# Altium project EnergyMeter_v2.PrjPCB
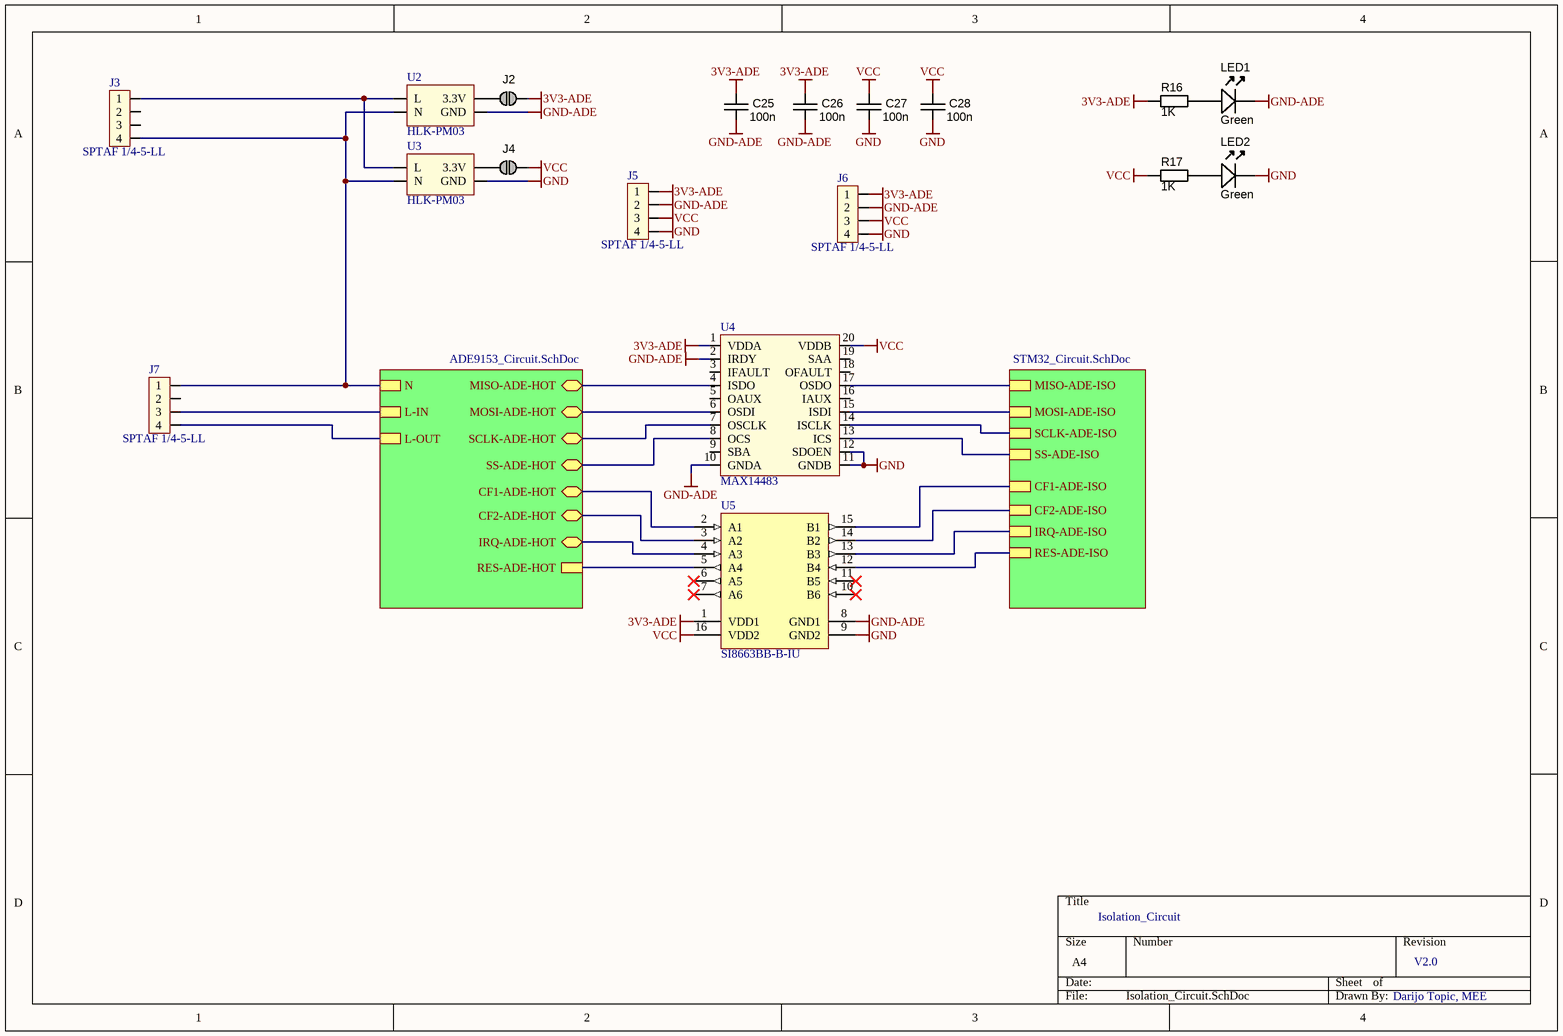
[diagram p0: Isolation_Circuit.SchDoc]
3 sheets, 121 parts. Net scope: hierarchical (ports join the sheet entries above them; power ports are global).
Board files: EnergyMeterV2.PcbDoc, EMv2PowerSupply.PcbDoc, EMv2MainBoard.PcbDoc
Sheets:
  Isolation_Circuit.SchDoc
    Designator = ADE9153_Circuit.SchDoc
    Designator = STM32_Circuit.SchDoc

## Sheet Isolation_Circuit.SchDoc
size A4

### Parts
C25  value 100n  [CAPC2012X135N]  (hidden comment: approved sub OK)
C26  value 100n  [CAPC2012X135N]  (hidden comment: approved sub OK)
C27  value 100n  [CAPC2012X135N]  (hidden comment: approved sub OK)
C28  value 100n  [CAPC2012X135N]  (hidden comment: approved sub OK)
J2  Jumper  [HDR1X2]  (value not drawn)  (no BOM)
J3  SPTAF 1/4-5-LL  [SPTAF 1/4-5-LL]
J4  Jumper  [HDR1X2]  (value not drawn)  (no BOM)
J5  SPTAF 1/4-5-LL  [SPTAF 1/4-5-LL]
J6  SPTAF 1/4-5-LL  [SPTAF 1/4-5-LL]
J7  SPTAF 1/4-5-LL  [SPTAF 1/4-5-LL]
LED1  Color: Green  [LED-0805-K]
LED2  Color: Green  [LED-0805-K]
R16  value 1K  [RESC2012X70N]  (hidden comment: Thick Film)
R17  value 1K  [RESC2012X70N]  (hidden comment: Thick Film)
U2  HLK-PM03  [HLK-PM03]
U3  HLK-PM03  [HLK-PM03]
U4  MAX14483  [SSOP20]
U5  SI8663BB-B-IU  [QSOP16]

### Sub-sheets
Designator = ADE9153_Circuit.SchDoc: CF2-ADE-HOT (bidir), IRQ-ADE-HOT (bidir), RES-ADE-HOT, MOSI-ADE-HOT (bidir), MISO-ADE-HOT (bidir), SCLK-ADE-HOT (bidir), SS-ADE-HOT (bidir), CF1-ADE-HOT (bidir), L-IN, L-OUT, N
Designator = STM32_Circuit.SchDoc: SS-ADE-ISO, MISO-ADE-ISO, CF1-ADE-ISO, CF2-ADE-ISO, IRQ-ADE-ISO, RES-ADE-ISO, MOSI-ADE-ISO, SCLK-ADE-ISO

### Nets
3V3-ADE: C25.1 C26.1 J2.1 J5.1 J6.1 R16.1 U4.1(VDDA) U5.1(VDD1)
GND: C27.2 C28.2 J5.4 J6.4 LED2.K U3.3(GND) U4.11(GNDB) U4.12(SDOEN) U5.9(GND2)
GND-ADE: C25.2 C26.2 J5.2 J6.2 LED1.K U2.3(GND) U4.2(IRDY) U4.10(GNDA) U5.8(GND1)
VCC: C27.1 C28.1 J4.1 J5.3 J6.3 R17.1 U4.20(VDDB) U5.16(VDD2)
RES-ADE-HOT: U5.5(A4) ; sheet Designator/RES-ADE-HOT
SS-ADE-HOT: U4.8(OCS) ; sheet Designator/SS-ADE-HOT
NetIC?_17: U5.14(B2) ; sheet Designator/CF2-ADE-ISO
NetIC?_20: U5.12(B4) ; sheet Designator/RES-ADE-ISO
NetIC?_21: U4.14(ISCLK) ; sheet Designator/SCLK-ADE-ISO
NetIC?_22: U4.17(OSDO) ; sheet Designator/MISO-ADE-ISO
NetIC?_23: U4.15(ISDI) ; sheet Designator/MOSI-ADE-ISO
NetIC?_24: U4.13(ICS) ; sheet Designator/SS-ADE-ISO
NetIC?_25: U5.15(B1) ; sheet Designator/CF1-ADE-ISO
NetIC?_27: U5.13(B3) ; sheet Designator/IRQ-ADE-ISO
NetJ2_2: J2.2 U2.4(3.3V)
NetJ3_1: J3.1 U2.1(L) U3.1(L)
NetJ3_4: J3.4 J7.1 U2.2(N) U3.2(N) ; sheet Designator/N
NetJ4_2: J4.2 U3.4(3.3V)
NetJ7_3: J7.3 ; sheet Designator/L-IN
NetJ7_4: J7.4 ; sheet Designator/L-OUT
NetLED1_A: LED1.A R16.2
NetLED2_A: LED2.A R17.2
NetU1_25: U5.3(A2) ; sheet Designator/CF2-ADE-HOT
NetU1_26: U5.2(A1) ; sheet Designator/CF1-ADE-HOT
NetU1_27: U5.4(A3) ; sheet Designator/IRQ-ADE-HOT
NetU1_29: U4.6(OSDI) ; sheet Designator/MOSI-ADE-HOT
NetU1_30: U4.4(ISDO) ; sheet Designator/MISO-ADE-HOT
NetU1_31: U4.7(OSCLK) ; sheet Designator/SCLK-ADE-HOT

Not connected (* = marked no-connect by the designer): J3 2 3; J7 2; U4 3(IFAULT) 5(OAUX) 9(SBA) 16(IAUX) 18(OFAULT) 19(SAA); U5 6(A5)* 7(A6)* 10(B6)* 11(B5)*

### Notes on the sheet
- Isolation_Circuit
- V2.0
- Darijo Topic, MEE

### Library data of the parts
C25-C28 = CAPC_100n_0805_X7R_50V_10%: Capacitor SMD Cer 100nF 10% 50V X7R 0805; Manufacturer 1: Kemet; Manufacturer Part Number 1: C0805C104K5RACTU; Ratings: 50V; X7R; Material: ceramic; SCDType: undef; Package / Case: 0805 (2012 metric); Tolerance: ±10%; Supplier 1: Digi-Key; Supplier Part Number 1: 399-1170-1-ND
J2 J4 = JUMP1: SMD jumper
LED1 LED2 = LED_SMD_Green_0805_6mcd: LED, 0805 SMD, Green; Manufacturer 1: LITE-ON; Manufacturer Part Number 1: LTST-C171GKT; Material: GaP; Ratings: 6 mcd; 569 nm; SCDType: source; Package / Case: 0805; Supplier 1: Digi-Key; Supplier Part Number 1: 160-1423-1-ND; Value: Green
R16 R17 = RES_1K_0805_1%: Resistor SMD chip 1k Ohm 0.125W 1% 0805; Manufacturer 1: Vishay/Dale; Manufacturer Part Number 1: CRCW08051K00FKEA; Ratings: 1/8W; SCDType: spec; Supplier 1: Digi-Key; Supplier Part Number 1: 541-1.00KCCT-ND; Package / Case: 0805 (2012 metric); Tolerance: ±1%
U2 U3 = HLK-PM03: AC 220V to DC 3.3V
U4 = MAX14483: 6-Channel, Low-Power, / 3.75kVRMS, SPI Digital Isolator; Mouser: 700-MAX14483AAP+
U5 = Si8663BC-B-IS1: Low Power Six-Channel Digital Isolator, 150 Mbps, 3.75 kVRMS Isolation Rating, -40 to 125 degC, 16-pin SOIC; Manufacturer: Silicon Labs; 10kV surge: FALSE; Channel Type: Unidirectional; Isolation Rating (kV): 3.75; Maximum Data Rate (Mbps): 150; Maximum Propagation Delay (ns): 13; Sub-Family: Isolators; DatasheetVersion: Rev. 1.4; PackageReference: SOIC-16-NB; PackageDescription: 16-Pin Small-Outline Integrated Circuit, Body 9.9 x 3.9 mm, Pitch 1.27 mm; Supplier 1: Digi-Key; Supplier Part Number 1: 336-2128-5-ND; Supplier 2: Mouser; Supplier Part Number 2: 634-SI8663BC-B-IS1; AEC-Q100: FALSE; Enable Control: FALSE; Mounting Technology: Surface Mount; Code_JEDEC: MS-012; Code_IPC: J-STD-020; PartNumber: Si8663BC-B-IS1; ComponentLink1Description: Manufacturer URL; ComponentLink1URL: http://www.silabs.com/; ComponentLink2Description: Datasheet; ComponentLink2URL: http://www.silabs.com/Support%20Documents/TechnicalDocs/Si866x.pdf; ComponentLink3Description: Package Specification; ComponentLink3URL: http://www.silabs.com/Support%20Documents/TechnicalDocs/si2401.pdf; Mouser: 634-SI8660BB-B-IU

## Sheet ADE9153_Circuit.SchDoc
size A
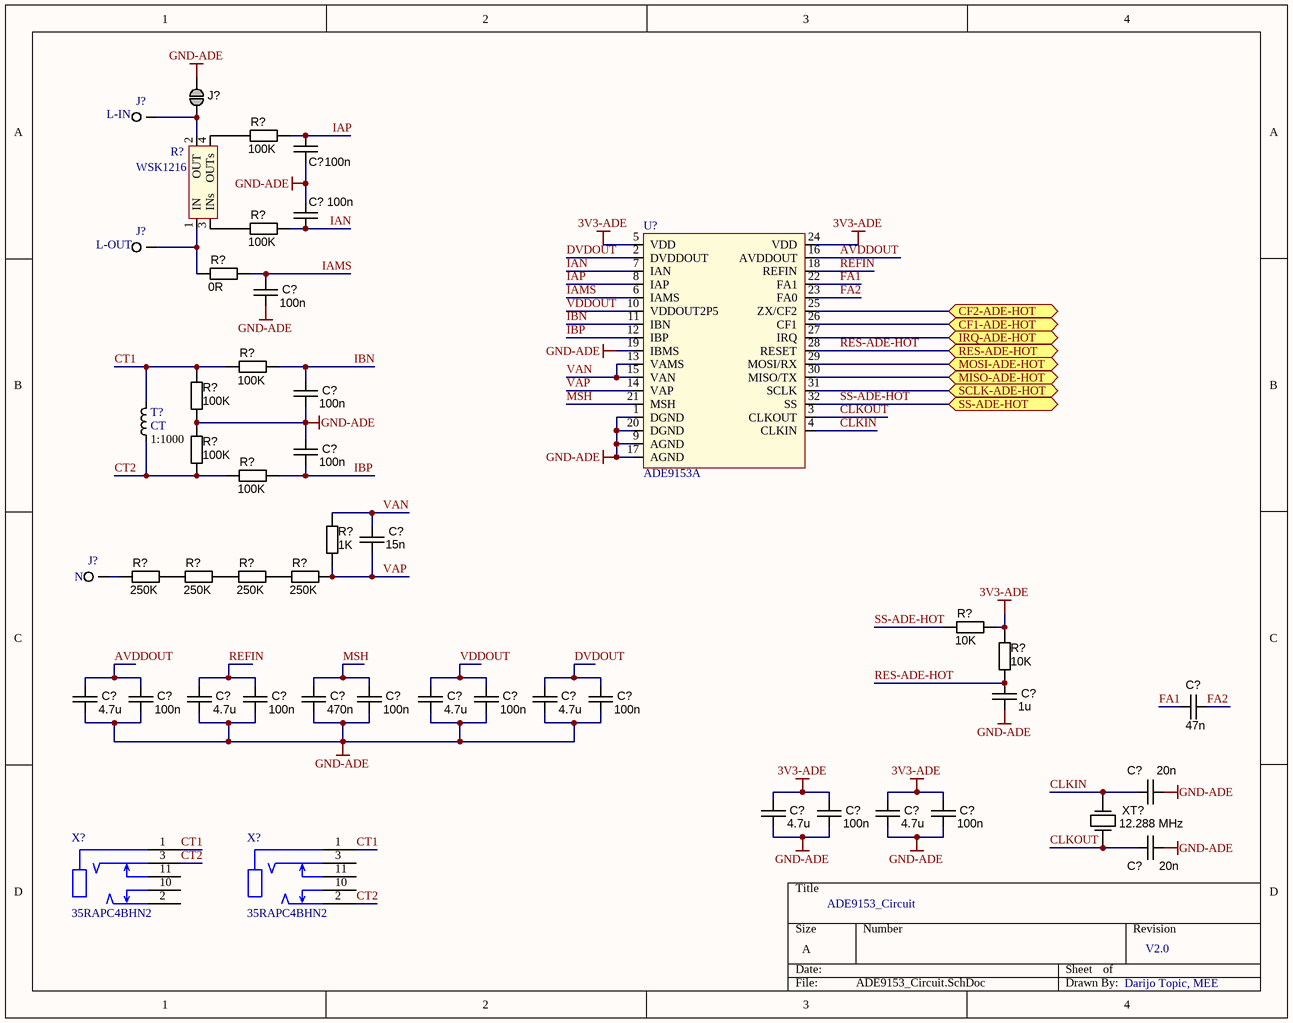
[diagram p1: ADE9153_Circuit.SchDoc]

### Parts
(Parts that share a designator on the sheet are numbered #1, #2 ... from top to bottom, then left to right.)
C1  value 100n  [CAPC2012X135N]  (hidden comment: approved sub OK)
C2  value 100n  [CAPC2012X135N]  (hidden comment: approved sub OK)
C3  value 100n  [CAPC2012X135N]  (hidden comment: approved sub OK)
C4  value 100n  [CAPC2012X135N]  (hidden comment: approved sub OK)
C5  value 100n  [CAPC2012X135N]  (hidden comment: approved sub OK)
C6  value 15n  [CAPC2012X135N]  (hidden comment: approved sub OK)
C7  value 47n  [CAPC2012X135N]  (hidden comment: approved sub OK)
C8  value 1u  [CAPC2012X135N]  (hidden comment: approved sub OK)
C9  value 4.7u  [CAPC2012X135N]  (hidden comment: approved sub OK)
C10  value 100n  [CAPC2012X135N]  (hidden comment: approved sub OK)
C11  value 4.7u  [CAPC2012X135N]  (hidden comment: approved sub OK)
C12  value 100n  [CAPC2012X135N]  (hidden comment: approved sub OK)
C13  value 470n  [CAPC2012X135N]  (hidden comment: approved sub OK)
C14  value 100n  [CAPC2012X135N]  (hidden comment: approved sub OK)
C15  value 4.7u  [CAPC2012X135N]  (hidden comment: approved sub OK)
C16  value 100n  [CAPC2012X135N]  (hidden comment: approved sub OK)
C17  value 4.7u  [CAPC2012X135N]  (hidden comment: approved sub OK)
C18  value 100n  [CAPC2012X135N]  (hidden comment: approved sub OK)
C19  value 20n  [CAPC2012X135N]  (hidden comment: approved sub OK)
C20  value 4.7u  [CAPC2012X135N]  (hidden comment: approved sub OK)
C21  value 100n  [CAPC2012X135N]  (hidden comment: approved sub OK)
C22  value 4.7u  [CAPC2012X135N]  (hidden comment: approved sub OK)
C23  value 100n  [CAPC2012X135N]  (hidden comment: approved sub OK)
C24  value 20n  [CAPC2012X135N]  (hidden comment: approved sub OK)
J?#1  L-IN  [Crimp Spade PCB 6.3mm]
J?#2  Jumper  [HDR1X2]  (value not drawn)  (no BOM)
J?#3  L-OUT  [Crimp Spade PCB 6.3mm]
J?#4  N  [Crimp Spade PCB 6.3mm]
R1  value 100K  [RESC2012X70N]  (hidden comment: Thick Film)
R2  WSK1216  [WSK1216]
R3  value 100K  [RESC2012X70N]  (hidden comment: Thick Film)
R4  value 0R  [RESC2012X70N]  (hidden comment: Thick Film)
R5  value 100K  [RESC2012X70N]  (hidden comment: Thick Film)
R6  value 100K  [RESC2012X70N]  (hidden comment: Thick Film)
R7  value 100K  [RESC2012X70N]  (hidden comment: Thick Film)
R8  value 100K  [RESC2012X70N]  (hidden comment: Thick Film)
R9  value 1K  [RESC2012X70N]  (hidden comment: Thick Film)
R10  value 250K  [RESC2012X70N]  (hidden comment: Thick Film)
R11  value 250K  [RESC2012X70N]  (hidden comment: Thick Film)
R12  value 250K  [RESC2012X70N]  (hidden comment: Thick Film)
R13  value 250K  [RESC2012X70N]  (hidden comment: Thick Film)
R14  value 10K  [RESC2012X70N]  (hidden comment: Thick Film)
R15  value 10K  [RESC2012X70N]  (hidden comment: Thick Film)
T?  CT  Ratio: 1:1000
U1  ADE9153A  [CP-32-12_L]
X2  35RAPC4BHN2  [35RAPC _ _ HN2]
X?  35RAPC4BHN2  [35RAPC _ _ HN2]
XT1  12.288 MHz  [ABLS7M2]

### Ports
CF1-ADE-HOT (bidir), CF2-ADE-HOT (bidir), IRQ-ADE-HOT (bidir), MISO-ADE-HOT (bidir), MOSI-ADE-HOT (bidir), RES-ADE-HOT (bidir), SCLK-ADE-HOT (bidir), SS-ADE-HOT (bidir)

### Nets
3V3-ADE: C20.1 C21.1 C22.1 C23.1 R14.1 R15.1 U1.5(VDD) U1.24(VDD)
GND-ADE: C1.2 C2.1 C3.2 C4.2 C5.1 C8.2 C9.2 C10.2 C11.2 C12.2 C13.2 C14.2 C15.2 C16.2 C17.2 C18.2 C19.1 C20.2 C21.2 C22.2 C23.2 C24.1 J?#2.1 R6.2 R7.1 U1.1(DGND) U1.9(AGND) U1.17(AGND) U1.19(IBMS) U1.20(DGND)
AVDDOUT: C9.1 C10.1 U1.16(AVDDOUT)
CLKIN: C19.2 U1.4(CLKIN) XT1.2(OUT)
CLKOUT: C24.2 U1.3(CLKOUT) XT1.1(IN)
CT1: R5.2 R6.1 T?.1 X2.1 X?.1
CT2: R7.2 R8.2 T?.2 X2.2 X?.3
DVDOUT: C17.1 C18.1 U1.2(DVDDOUT)
FA1: C7.1 U1.22(FA1)
FA2: C7.2 U1.23(FA0)
IAMS: C3.1 R4.1 U1.6(IAMS)
IAN: C2.2 R3.1 U1.7(IAN)
IAP: C1.1 R1.1 U1.8(IAP)
IBN: C4.1 R5.1 U1.11(IBN)
IBP: C5.2 R8.1 U1.12(IBP)
MSH: C13.1 C14.1 U1.21(MSH)
REFIN: C11.1 C12.1 U1.18(REFIN)
RES-ADE-HOT: C8.1 R15.2 U1.28(RESET) ; port RES-ADE-HOT
SS-ADE-HOT: R14.2 U1.32(SS) ; port SS-ADE-HOT
VAN: C6.1 R9.1 U1.13(VAMS) U1.15(VAN)
VAP: C6.2 R9.2 R13.1 U1.14(VAP)
VDDOUT: C15.1 C16.1 U1.10(VDDOUT2P5)
NetJ?#1_1: J?#1.1 J?#2.2 R2.2(OUT)
NetJ?#3_1: J?#3.1 R2.1(IN) R4.2
NetJ?#4_1: J?#4.1 R10.2
NetR1_2: R1.2 R2.4(OUTs)
NetR2_3: R2.3(INs) R3.2
NetU1_25: U1.25(ZX/CF2) ; port CF2-ADE-HOT
NetU1_26: U1.26(CF1) ; port CF1-ADE-HOT
NetU1_27: U1.27(IRQ) ; port IRQ-ADE-HOT
NetU1_29: U1.29(MOSI/RX) ; port MOSI-ADE-HOT
NetU1_30: U1.30(MISO/TX) ; port MISO-ADE-HOT
NetU1_31: U1.31(SCLK) ; port SCLK-ADE-HOT

Not connected (* = marked no-connect by the designer): R10 1; R11 1 2; R12 1 2; R13 2; X2 3 10 11; X? 2 10 11

### Notes on the sheet
- ADE9153_Circuit
- V2.0
- Darijo Topic, MEE

### Library data of the parts
C1-C24 = CAPC_100n_0805_X7R_50V_10%: as C25 on sheet Isolation_Circuit; Package / Case: 0805 (2012 metric); Tolerance: ±10%; Supplier 1: Digi-Key; Supplier Part Number 1: 399-1170-1-ND
J?#1 J?#3 J?#4 = Crimp Spade Connector: Crimp Spade Connector 6.3mm
J?#2 = JUMP1: SMD jumper
R1 R3-R15 = RES_100K_0805_1%: Resistor SMD chip 100k Ohm 0.125W 1% 0805; Manufacturer 1: Vishay/Dale; Manufacturer Part Number 1: CRCW0805100KFKEA; Ratings: 1/8W; SCDType: spec; Package / Case: 0805 (2012 metric); Supplier 1: Digi-Key; Supplier Part Number 1: 541-100KCCT-ND
R2 = wsk1216: Power Metal Strip® Resistors, Low Value, / High Power, Surface-Mount, 4-Terminal; Mouser: 71-WSK12161L000FEA
T? = Current Transformer
U1 = ADE9153A: Energy Metering IC with Autocalibration; Mouser: 584-ADE9153AACPZ
X2 X? = Audio jack 35RAPC4BHN2: Switchcraft 35RAPC4BHN2, 3.5mm stereo jack
XT1 = Crystal_6MHz_HC49/US: Resonator Ceramic 6.00 MHz 30ppm; Manufacturer 1: CTS-Frequency Controls; Manufacturer Part Number 1: ATS060BSM-1; Frequency: 6MHz; Frequency Stability: ±50ppm; Load Capacitance: 18pF; Operating Mode: Fundamental; Parameter Name: 0.169" (4.30mm); SCDType: spec; Package / Case: HC49/US-SM; Ratings: 6.00 MHz; Supplier 1: Digi-Key; Supplier Part Number 1: CTX882CT-ND; Type: MHz Crystal; Frequency Tolerance: ±30ppm; Operating Temperature: -20°C ~ 70°C; Mounting Type: Surface Mount; Size / Dimension: 0.437" L x 0.190" W (11.10mm x 4.83mm); ComponentLink1URL: http://www.ctscorp.com/components/Datasheets/008-0309-0.pdf; ComponentLink1Description: http://www.ctscorp.com/components/Datasheets/008-0309-0.pdf

## Sheet STM32_Circuit.SchDoc
size A4
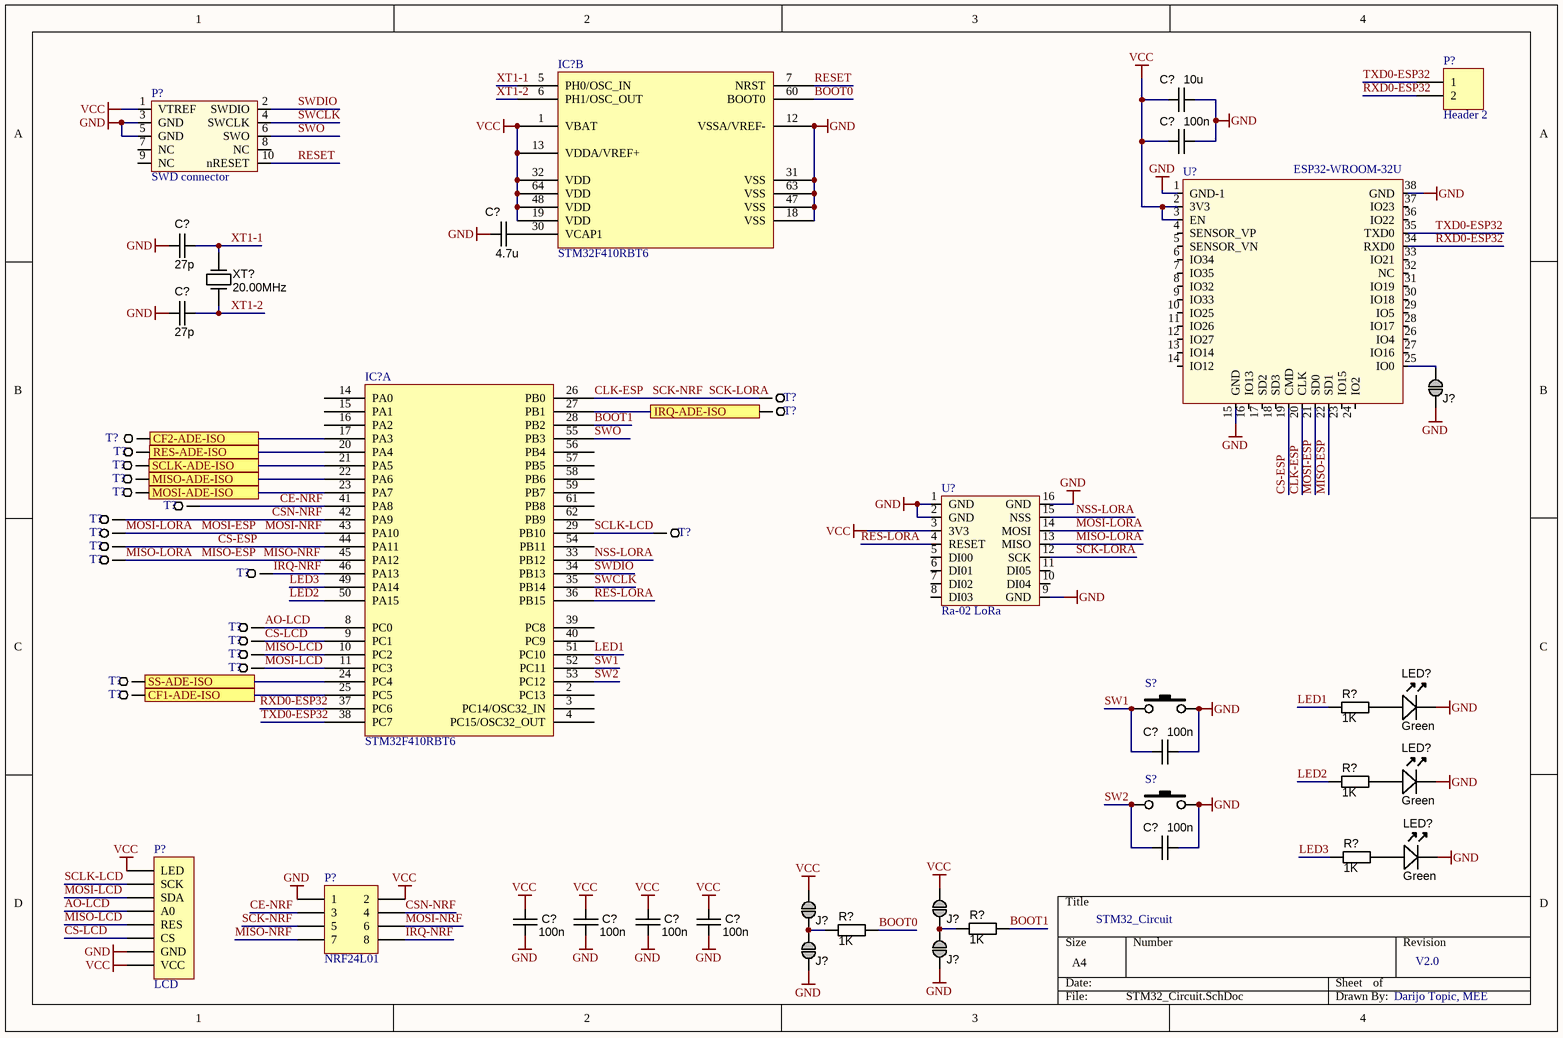
[diagram p2: STM32_Circuit.SchDoc]

### Parts
(Parts that share a designator on the sheet are numbered #1, #2 ... from top to bottom, then left to right.)
C29  value 10u  [CAPC2012X135N]  (hidden comment: approved sub OK)
C30  value 100n  [CAPC2012X135N]  (hidden comment: approved sub OK)
C31  value 4.7u  [CAPC2012X135N]  (hidden comment: approved sub OK)
C32  value 27p  [CAPC2012X135N]  (hidden comment: approved sub OK)
C33  value 27p  [CAPC2012X135N]  (hidden comment: approved sub OK)
C34  value 100n  [CAPC2012X135N]  (hidden comment: approved sub OK)
C35  value 100n  [CAPC2012X135N]  (hidden comment: approved sub OK)
C36  value 100n  [CAPC2012X135N]  (hidden comment: approved sub OK)
C37  value 100n  [CAPC2012X135N]  (hidden comment: approved sub OK)
C38  value 100n  [CAPC2012X135N]  (hidden comment: approved sub OK)
C39  value 100n  [CAPC2012X135N]  (hidden comment: approved sub OK)
IC1  STM32F410RBT6  [STM32F410RBT6]  (part B of 2)
IC?  STM32F410RBT6  [STM32F410RBT6]  (part A of 2)
J?#5  Jumper  [HDR1X2]  (value not drawn)  (no BOM)
J?#6  Jumper  [HDR1X2]  (value not drawn)  (no BOM)
J?#7  Jumper  [HDR1X2]  (value not drawn)  (no BOM)
J?#8  Jumper  [HDR1X2]  (value not drawn)  (no BOM)
J?#9  Jumper  [HDR1X2]  (value not drawn)  (no BOM)
LED3  Color: Green  [LED-0805-K]
LED4  Color: Green  [LED-0805-K]
LED5  Color: Green  [LED-0805-K]
P1  Header 2  [HDR1X2]
P2  SWD connector  [SWD connector]
P6  LCD  [HDR1X8]
P7  NRF24L01  [HDR2X4]
R18  value 1K  [RESC2012X70N]  (hidden comment: Thick Film)
R19  value 1K  [RESC2012X70N]  (hidden comment: Thick Film)
R20  value 1K  [RESC2012X70N]  (hidden comment: Thick Film)
R21  value 1K  [RESC2012X70N]  (hidden comment: Thick Film)
R22  value 1K  [RESC2012X70N]  (hidden comment: Thick Film)
S1  SMD_BUTTON  [SMD_BUTTON]  (value not drawn)
S2  SMD_BUTTON  [SMD_BUTTON]  (value not drawn)
T2  Test Point  [PIN1]  (value not drawn)
T3  Test Point  [PIN1]  (value not drawn)
T4  Test Point  [PIN1]  (value not drawn)
T5  Test Point  [PIN1]  (value not drawn)
T6  Test Point  [PIN1]  (value not drawn)
T7  Test Point  [PIN1]  (value not drawn)
T8  Test Point  [PIN1]  (value not drawn)
T9  Test Point  [PIN1]  (value not drawn)
T10  Test Point  [PIN1]  (value not drawn)
T11  Test Point  [PIN1]  (value not drawn)
T12  Test Point  [PIN1]  (value not drawn)
T13  Test Point  [PIN1]  (value not drawn)
T14  Test Point  [PIN1]  (value not drawn)
T15  Test Point  [PIN1]  (value not drawn)
T16  Test Point  [PIN1]  (value not drawn)
T17  Test Point  [PIN1]  (value not drawn)
T18  Test Point  [PIN1]  (value not drawn)
T19  Test Point  [PIN1]  (value not drawn)
T20  Test Point  [PIN1]  (value not drawn)
T21  Test Point  [PIN1]  (value not drawn)
U6  ESP32-WROOM-32U  [ESP32-WROOM-32U]
U7  Ra-02 LoRa  [Ra-02 LoRa]
XT2  20.00MHz  [CRYSTAL_HC49-US-SM]

### Ports
CF1-ADE-ISO, CF2-ADE-ISO, IRQ-ADE-ISO, MISO-ADE-ISO, MOSI-ADE-ISO, RES-ADE-ISO, SCLK-ADE-ISO, SS-ADE-ISO

### Nets
GND: C29.1 C30.1 C31.2 C32.1 C33.1 C34.1 C35.1 C36.2 C37.2 C38.2 C39.2 IC1.12(VSSA/VREF-) IC1.18(VSS) IC1.31(VSS) IC1.47(VSS) IC1.63(VSS) J?#5.2 J?#8.2 J?#9.2 LED3.K LED4.K LED5.K P2.3(GND) P2.5(GND) P6.7(GND) P7.1 S1.2 S2.2 U6.1(GND-1) U6.15(GND) U6.38(GND) U7.1(GND) U7.2(GND) U7.9(GND) U7.16(GND)
VCC: C29.2 C30.2 C36.1 C37.1 C38.1 C39.1 IC1.1(VBAT) IC1.13(VDDA/VREF+) IC1.19(VDD) IC1.32(VDD) IC1.48(VDD) IC1.64(VDD) J?#6.1 J?#7.1 P2.1(VTREF) P6.1(LED) P6.8(VCC) P7.2 U6.2(3V3) U6.3(EN) U7.3(3V3)
AO-LCD: IC?.8(PC0) P6.4(A0) T16.1
BOOT0: IC1.60(BOOT0) R21.2
BOOT1: IC?.28(PB2) R22.2
CE-NRF: IC?.41(PA8) P7.3 T9.1
CLK-ESP: IC?.26(PB0) P7.5 T2.1 U6.20(CLK) U7.12(SCK)  [also labelled SCK-LORA, SCK-NRF]
CS-ESP: IC?.44(PA11) T13.1 U6.19(CMD)
CS-LCD: IC?.9(PC1) P6.6(CS) T17.1
CSN-NRF: IC?.42(PA9) P7.4 T10.1
IRQ-NRF: IC?.46(PA13) P7.8 T15.1
LED1: IC?.51(PC10) R18.1
LED2: IC?.50(PA15) R19.1
LED3: IC?.49(PA14) R20.1
MISO-ESP: IC?.45(PA12) P7.7 T14.1 U6.22(SD1) U7.13(MISO)  [also labelled MISO-LORA, MISO-NRF]
MISO-LCD: IC?.10(PC2) P6.5(RES) T18.1
MOSI-ESP: IC?.43(PA10) P7.6 T11.1 U6.21(SD0) U7.14(MOSI)  [also labelled MOSI-LORA, MOSI-NRF]
MOSI-LCD: IC?.11(PC3) P6.3(SDA) T19.1
NSS-LORA: IC?.33(PB12) U7.15(NSS)
RES-LORA: IC?.36(PB15) U7.4(RESET)
RESET: IC1.7(NRST) P2.10(nRESET)
RXD0-ESP32: IC?.37(PC6) P1.2 U6.34(RXD0)
SCLK-LCD: IC?.29(PB10) P6.2(SCK) T12.1
SW1: C34.2 IC?.52(PC11) S1.1
SW2: C35.2 IC?.53(PC12) S2.1
SWCLK: IC?.35(PB14) P2.4(SWCLK)
SWDIO: IC?.34(PB13) P2.2(SWDIO)
SWO: IC?.55(PB3) P2.6(SWO)
TXD0-ESP32: IC?.38(PC7) P1.1 U6.35(TXD0)
XT1-1: C32.2 IC1.5(PH0/OSC_IN) XT2.2(OUT)
XT1-2: C33.2 IC1.6(PH1/OSC_OUT) XT2.1(IN)
NetC31_1: C31.1 IC1.30(VCAP1)
NetIC?_17: IC?.17(PA3) T4.1 ; port CF2-ADE-ISO
NetIC?_20: IC?.20(PA4) T5.1 ; port RES-ADE-ISO
NetIC?_21: IC?.21(PA5) T6.1 ; port SCLK-ADE-ISO
NetIC?_22: IC?.22(PA6) T7.1 ; port MISO-ADE-ISO
NetIC?_23: IC?.23(PA7) T8.1 ; port MOSI-ADE-ISO
NetIC?_24: IC?.24(PC4) T20.1 ; port SS-ADE-ISO
NetIC?_25: IC?.25(PC5) T21.1 ; port CF1-ADE-ISO
NetIC?_27: IC?.27(PB1) T3.1 ; port IRQ-ADE-ISO
NetJ?#5_1: J?#5.1 U6.25(IO0)
NetJ?#6_2: J?#6.2 J?#8.1 R21.1
NetJ?#7_2: J?#7.2 J?#9.1 R22.1
NetLED3_A: LED3.A R18.2
NetLED4_A: LED4.A R19.2
NetLED5_A: LED5.A R20.2

Not connected (* = marked no-connect by the designer): IC? 2(PC13) 3(PC14/OSC32_IN) 4(PC15/OSC32_OUT) 14(PA0) 15(PA1) 16(PA2) 39(PC8) 40(PC9) 54(PB11) 56(PB4) 57(PB5) 58(PB6) 59(PB7) 61(PB8) 62(PB9); P2 7(NC) 8(NC) 9(NC); U6 4(SENSOR_VP) 5(SENSOR_VN) 6(IO34) 7(IO35) 8(IO32) 9(IO33) 10(IO25) 11(IO26) 12(IO27) 13(IO14) 14(IO12) 16(IO13) 17(SD2) 18(SD3) 23(IO15) 24(IO2) 26(IO4) 27(IO16) 28(IO17) 29(IO5) 30(IO18) 31(IO19) 32(NC) 33(IO21) 36(IO22) 37(IO23); U7 5(DI00) 6(DI01) 7(DI02) 8(DI03) 10(DI04) 11(DI05)

### Notes on the sheet
- STM32_Circuit
- V2.0
- Darijo Topic, MEE

### Library data of the parts
C29-C31 C34-C39 = CAPC_100n_0805_X7R_50V_10%: as C25 on sheet Isolation_Circuit; Package / Case: 0805 (2012 metric); Tolerance: ±10%; Supplier 1: Digi-Key; Supplier Part Number 1: 399-1170-1-ND
C32 C33 = CAPC_27p_0805_NP0_50V_5%: Capacitor SMD Cer 27pF 5% 50V NP0 0805; Manufacturer 1: Panasonic - ECG; Manufacturer Part Number 1: ECJ-2VC1H270J; Ratings: 50V; NP0; SCDType: undef; Tolerance: ±5%; Operating Temperature: -55°C ~ 125°C; Package / Case: 0805 (2012 metric); Supplier 1: Digi-Key; Supplier Part Number 1: PCC270CGCT-ND
IC1 IC? = STM32F410RBT6: Manufacturer: STMICROELECTRONICS; Manufacturer Part No: STM32F410RBT6; Component Type: IC; Order Code: *; Supplier: *
J?#5-J?#9 = JUMP1: SMD jumper
LED3-LED5 = LED_SMD_Green_0805_6mcd: as LED1 on sheet Isolation_Circuit; Package / Case: 0805; Supplier 1: Digi-Key; Supplier Part Number 1: 160-1423-1-ND; Value: Green
P1 = Header 2: Header, 2-Pin; LatestRevisionDate: 17-Jul-2002; LatestRevisionNote: Re-released for DXP Platform.; Publisher: Altium Limited
P2 = SW_debug
P6 = Header 8: Header, 8-Pin; LatestRevisionDate: 17-Jul-2002; LatestRevisionNote: Re-released for DXP Platform.; Publisher: Altium Limited
P7 = Header 4X2: Header, 4-Pin, Dual row; LatestRevisionDate: 17-Jul-2002; LatestRevisionNote: Re-released for DXP Platform.; Publisher: Altium Limited
R18-R22 = RES_1K_0805_1%: as R16 on sheet Isolation_Circuit; Supplier 1: Digi-Key; Supplier Part Number 1: 541-1.00KCCT-ND; Package / Case: 0805 (2012 metric); Tolerance: ±1%
T2-T21 = Test_Point
U6 = ESP32-WROOM-32U: Wi-Fi+BT+BLE MCU modules; Mouser: 356-ES32WROOM32U16MB; ComponentLink1Description: Espressif; ComponentLink1URL: https://hr.mouser.com/datasheet/2/891/esp32-wroom-32d_esp32-wroom-32u_datasheet_en-1365844.pdf
XT2 = Crystal_6MHz_HC49/US: as XT1 on sheet ADE9153_Circuit; Package / Case: HC49/US-SM; Ratings: 6.00 MHz; Supplier 1: Digi-Key; Supplier Part Number 1: CTX882CT-ND; Type: MHz Crystal; Frequency Tolerance: ±30ppm; Operating Temperature: -20°C ~ 70°C; Mounting Type: Surface Mount; Size / Dimension: 0.437" L x 0.190" W (11.10mm x 4.83mm); ComponentLink1URL: http://www.ctscorp.com/components/Datasheets/008-0309-0.pdf; ComponentLink1Description: http://www.ctscorp.com/components/Datasheets/008-0309-0.pdf

## Nets that join several sheets
3V3-ADE: Isolation_Circuit (8 pins), ADE9153_Circuit (8 pins)
GND: Isolation_Circuit (9 pins), STM32_Circuit (35 pins)
GND-ADE: Isolation_Circuit (9 pins), ADE9153_Circuit (30 pins)
VCC: Isolation_Circuit (8 pins), STM32_Circuit (21 pins)
NetIC?_17: Isolation_Circuit (U5.14), STM32_Circuit (IC?.17 T4.1)
NetIC?_20: Isolation_Circuit (U5.12), STM32_Circuit (IC?.20 T5.1)
NetIC?_21: Isolation_Circuit (U4.14), STM32_Circuit (IC?.21 T6.1)
NetIC?_22: Isolation_Circuit (U4.17), STM32_Circuit (IC?.22 T7.1)
NetIC?_23: Isolation_Circuit (U4.15), STM32_Circuit (IC?.23 T8.1)
NetIC?_24: Isolation_Circuit (U4.13), STM32_Circuit (IC?.24 T20.1)
NetIC?_25: Isolation_Circuit (U5.15), STM32_Circuit (IC?.25 T21.1)
NetIC?_27: Isolation_Circuit (U5.13), STM32_Circuit (IC?.27 T3.1)
NetU1_25: Isolation_Circuit (U5.3), ADE9153_Circuit (U1.25)
NetU1_26: Isolation_Circuit (U5.2), ADE9153_Circuit (U1.26)
NetU1_27: Isolation_Circuit (U5.4), ADE9153_Circuit (U1.27)
NetU1_29: Isolation_Circuit (U4.6), ADE9153_Circuit (U1.29)
NetU1_30: Isolation_Circuit (U4.4), ADE9153_Circuit (U1.30)
NetU1_31: Isolation_Circuit (U4.7), ADE9153_Circuit (U1.31)
RES-ADE-HOT: Isolation_Circuit (U5.5), ADE9153_Circuit (C8.1 R15.2 U1.28)
SS-ADE-HOT: Isolation_Circuit (U4.8), ADE9153_Circuit (R14.2 U1.32)